# Altium schematic sheet Splitter.SchDoc
size A4; Organization: Altium Limited; Address1: L3, 12a Rodborough Rd; Address2: Frenchs Forest; Address3: NSW; Address4: Australia 2086
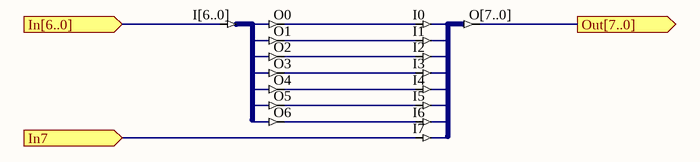
[diagram p0: Splitter.SchDoc]

## Parts
U110  J8S_8B  (value not drawn)
U116  J7B_7S  (value not drawn)

## Ports
In7 (in), In[6..0] (in), Out[7..0] (out)

## Nets
In7: U110.I7 ; port In7
In[6..0]: U116.I[6..0] ; port In[6..0]
Out[7..0]: U110.O[7..0] ; port Out[7..0]
NetU110_I0: U110.I0 U116.O0
NetU110_I1: U110.I1 U116.O1
NetU110_I2: U110.I2 U116.O2
NetU110_I3: U110.I3 U116.O3
NetU110_I4: U110.I4 U116.O4
NetU110_I5: U110.I5 U116.O5
NetU110_I6: U110.I6 U116.O6

## Notes on the sheet
- Title
- Size:
- Date:
- A4
- Number:
- Time:
- Revision:
- Sheet
- of
- File:

## Library data of the parts
U110 = J8S_8B: 8 Single pin inputs to single 8-Bit output bus; ArchiveName: GENERIC; VHDLIB_SIM: GENERIC_LIB; Published: 29-Jan-2004; Publisher: Altium Limited; Core Revision: 1.00.00
U116 = J7B_7S: 7-Bit input bus to 7 Single pin outputs; ArchiveName: GENERIC; VHDLIB_SIM: GENERIC_LIB; Published: 29-Jan-2004; Publisher: Altium Limited; Core Revision: 1.00.00